# Altium schematic sheet CPU_Power_XTAL_Prog.SchDoc
size B
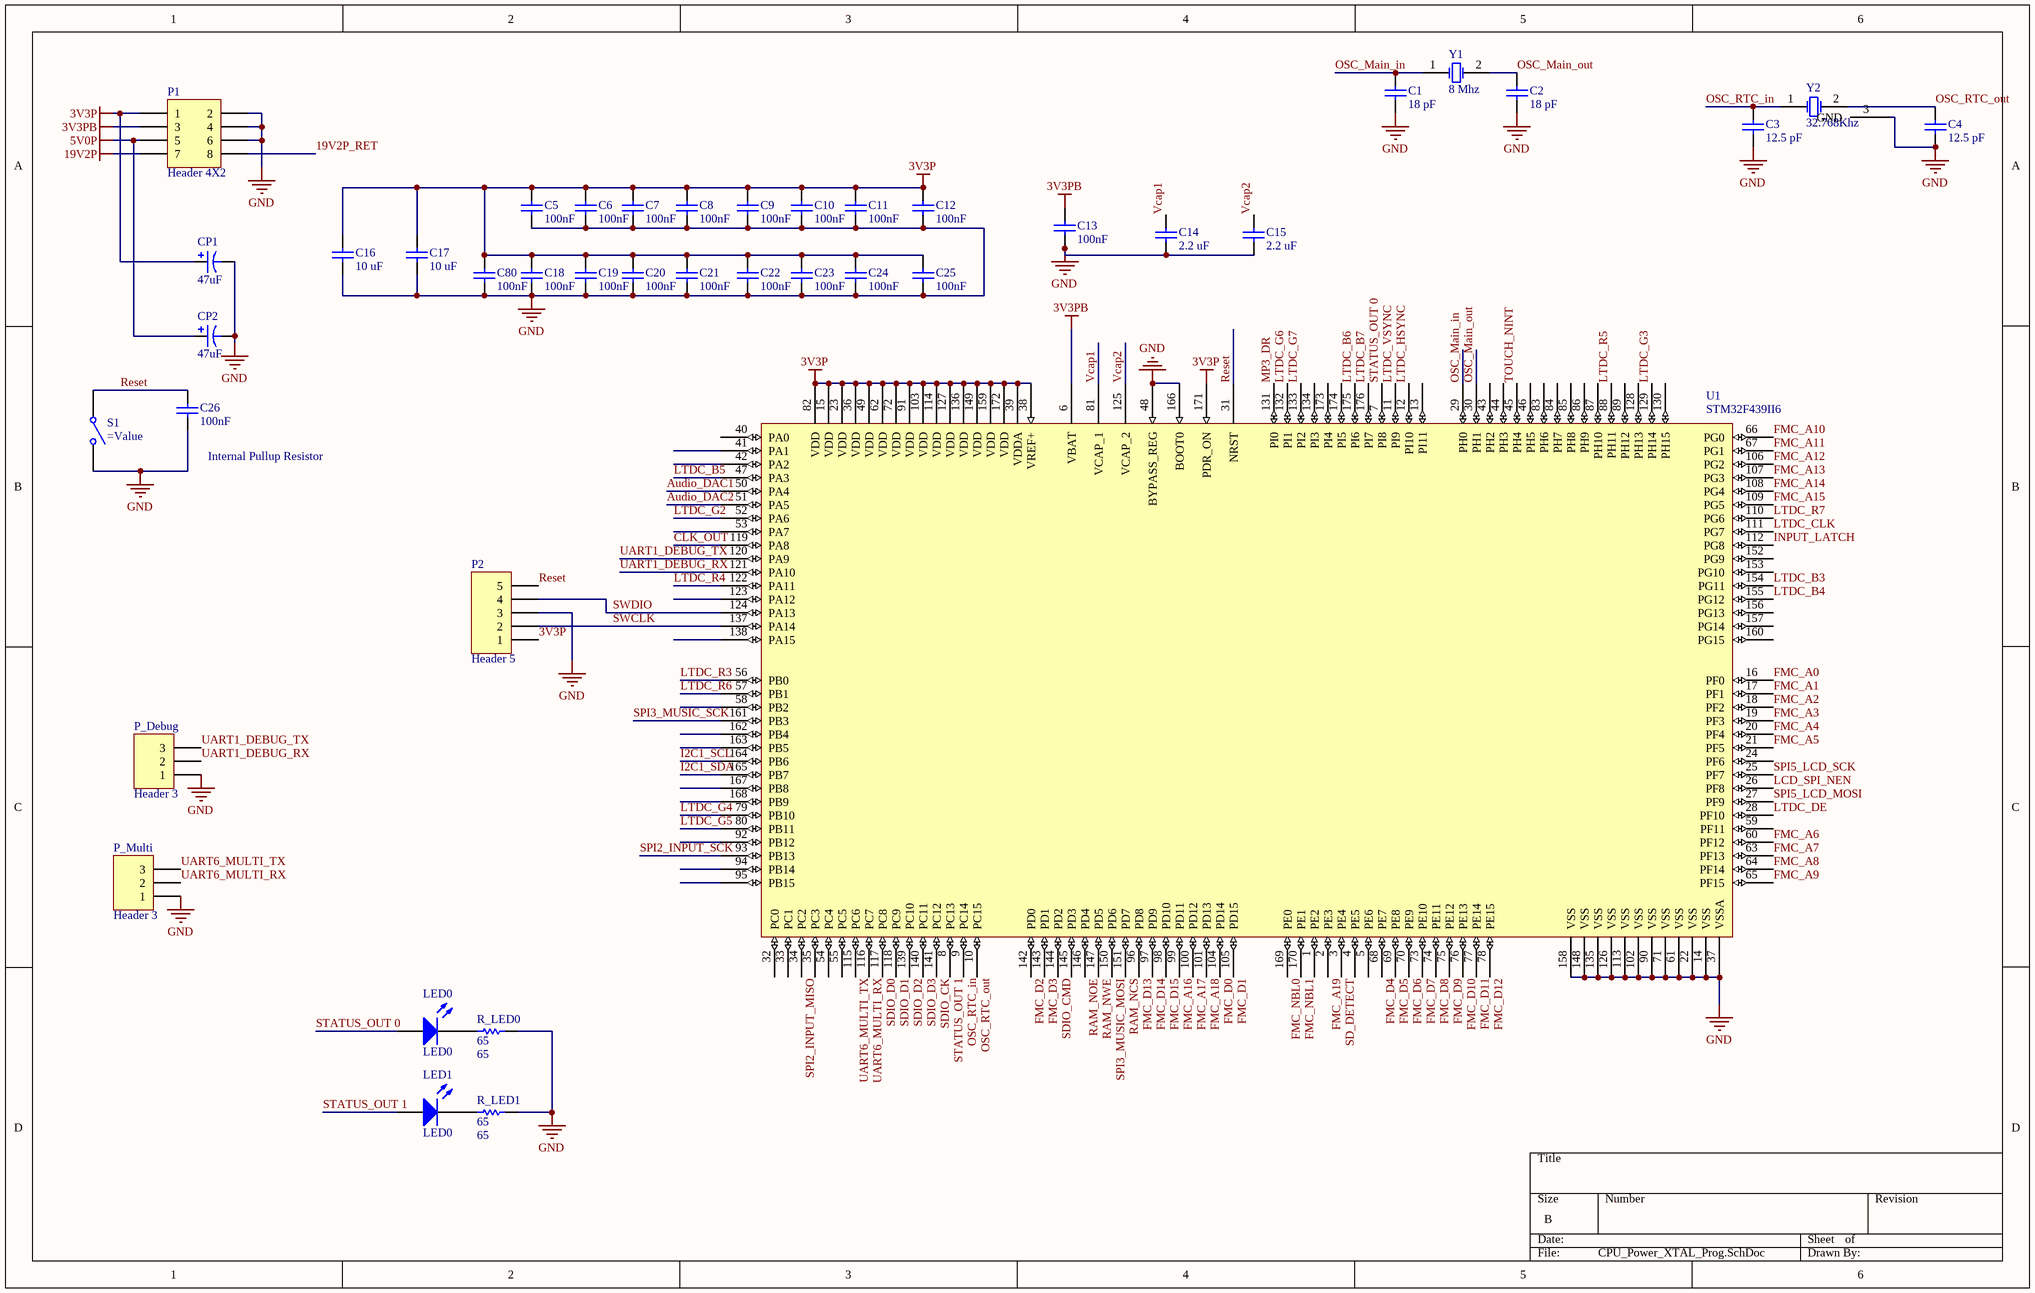
[diagram p0: CPU_Power_XTAL_Prog.SchDoc]

## Parts
C1  18 pF  [C0805]
C2  18 pF  [C0805]
C3  12.5 pF  [C0805]
C4  12.5 pF  [C0805]
C5  100nF  [C0805]
C6  100nF  [C0805]
C7  100nF  [C0805]
C8  100nF  [C0805]
C9  100nF  [C0805]
C10  100nF  [C0805]
C11  100nF  [C0805]
C12  100nF  [C0805]
C13  100nF  [C0805]
C14  2.2 uF  [C0805]
C15  2.2 uF  [C0805]
C16  10 uF  [C0805]
C17  10 uF  [C0805]
C18  100nF  [C0805]
C19  100nF  [C0805]
C20  100nF  [C0805]
C21  100nF  [C0805]
C22  100nF  [C0805]
C23  100nF  [C0805]
C24  100nF  [C0805]
C25  100nF  [C0805]
C26  100nF  [C0805]
C80  100nF  [C0805]
CP1  47uF  [KemetC3]
CP2  47uF  [KemetC3]
LED0  LED0  [LED-LTST]
LED1  LED0  [LED-LTST]
P1  Header 4X2  [Molex MiniFit Jr8]
P2  Header 5  [HDR1X5]
P_Debug  Header 3  [HDR1X3]
P_Multi  Header 3  [HDR1X3]
R_LED0  65  [6-0805_M]
R_LED1  65  [6-0805_M]
S1  (no value)  [Reset_Button]
U1  STM32F439II6  [LQFP76]
Y1  8 Mhz  [HC-49U]
Y2  32.768Khz  [C-2Type Crystal]

## Nets
3V3P: C5.2 C6.2 C7.2 C8.2 C9.2 C10.2 C11.2 C12.2 C16.2 C17.2 C18.2 C19.2 C20.2 C21.2 C22.2 C23.2 C24.2 C25.2 C80.2 CP1.2 P1.1 P2.1 U1.15(VDD) U1.23(VDD) U1.36(VDD) U1.38(VREF+) U1.39(VDDA) U1.49(VDD) U1.62(VDD) U1.72(VDD) U1.82(VDD) U1.91(VDD) U1.103(VDD) U1.114(VDD) U1.127(VDD) U1.136(VDD) U1.149(VDD) U1.159(VDD) U1.171(PDR_ON) U1.172(VDD)
3V3PB: C13.1 P1.3 U1.6(VBAT)
5V0P: CP2.2 P1.5
19V2P: P1.7
GND: C1.1 C2.1 C3.1 C4.1 C5.1 C6.1 C7.1 C8.1 C9.1 C10.1 C11.1 C12.1 C13.2 C14.2 C15.2 C16.1 C17.1 C18.1 C19.1 C20.1 C21.1 C22.1 C23.1 C24.1 C25.1 C26.1 C80.1 CP1.1 CP2.1 P1.2 P1.4 P1.6 P2.3 P_Debug.1 P_Multi.1 R_LED0.2 R_LED1.2 S1.1(NO) U1.14(VSS) U1.22(VSS) U1.37(VSSA) U1.48(BYPASS_REG) U1.61(VSS) U1.71(VSS) U1.90(VSS) U1.102(VSS) U1.113(VSS) U1.126(VSS) U1.135(VSS) U1.148(VSS) U1.158(VSS) U1.166(BOOT0) Y2.3(GND)
19V2P_RET: P1.8
Audio_DAC1: U1.50(PA4)
Audio_DAC2: U1.51(PA5)
CLK_OUT: U1.119(PA8)
FMC_A0: U1.16(PF0)
FMC_A1: U1.17(PF1)
FMC_A2: U1.18(PF2)
FMC_A3: U1.19(PF3)
FMC_A4: U1.20(PF4)
FMC_A5: U1.21(PF5)
FMC_A6: U1.60(PF12)
FMC_A7: U1.63(PF13)
FMC_A8: U1.64(PF14)
FMC_A9: U1.65(PF15)
FMC_A10: U1.66(PG0)
FMC_A11: U1.67(PG1)
FMC_A12: U1.106(PG2)
FMC_A13: U1.107(PG3)
FMC_A14: U1.108(PG4)
FMC_A15: U1.109(PG5)
FMC_A16: U1.99(PD11)
FMC_A17: U1.100(PD12)
FMC_A18: U1.101(PD13)
FMC_A19: U1.2(PE3)
FMC_D0: U1.104(PD14)
FMC_D1: U1.105(PD15)
FMC_D2: U1.142(PD0)
FMC_D3: U1.143(PD1)
FMC_D4: U1.68(PE7)
FMC_D5: U1.69(PE8)
FMC_D6: U1.70(PE9)
FMC_D7: U1.73(PE10)
FMC_D8: U1.74(PE11)
FMC_D9: U1.75(PE12)
FMC_D10: U1.76(PE13)
FMC_D11: U1.77(PE14)
FMC_D12: U1.78(PE15)
FMC_D13: U1.96(PD8)
FMC_D14: U1.97(PD9)
FMC_D15: U1.98(PD10)
FMC_NBL0: U1.169(PE0)
FMC_NBL1: U1.170(PE1)
I2C1_SCL: U1.164(PB6)
I2C1_SDA: U1.165(PB7)
INPUT_LATCH: U1.112(PG8)
LCD_SPI_NEN: U1.26(PF8)
LTDC_B3: U1.154(PG11)
LTDC_B4: U1.155(PG12)
LTDC_B5: U1.47(PA3)
LTDC_B6: U1.175(PI6)
LTDC_B7: U1.176(PI7)
LTDC_CLK: U1.111(PG7)
LTDC_DE: U1.28(PF10)
LTDC_G2: U1.52(PA6)
LTDC_G3: U1.129(PH14)
LTDC_G4: U1.79(PB10)
LTDC_G5: U1.80(PB11)
LTDC_G6: U1.132(PI1)
LTDC_G7: U1.133(PI2)
LTDC_HSYNC: U1.12(PI10)
LTDC_R3: U1.56(PB0)
LTDC_R4: U1.122(PA11)
LTDC_R5: U1.88(PH11)
LTDC_R6: U1.57(PB1)
LTDC_R7: U1.110(PG6)
LTDC_VSYNC: U1.11(PI9)
MP3_DR: U1.131(PI0)
OSC_Main_in: C1.2 U1.29(PH0) Y1.1(OSC1)
OSC_Main_out: C2.2 U1.30(PH1) Y1.2(OSC2)
OSC_RTC_in: C3.2 U1.9(PC14) Y2.1(OSC1)
OSC_RTC_out: C4.2 U1.10(PC15) Y2.2(OSC2)
RAM_NCS: U1.151(PD7)
RAM_NOE: U1.146(PD4)
RAM_NWE: U1.147(PD5)
Reset: C26.2 P2.5 S1.0(COMMON) U1.31(NRST)
SD_DETECT: U1.3(PE4)
SDIO_CK: U1.141(PC12)
SDIO_CMD: U1.144(PD2)
SDIO_D0: U1.117(PC8)
SDIO_D1: U1.118(PC9)
SDIO_D2: U1.139(PC10)
SDIO_D3: U1.140(PC11)
SPI2_INPUT_MISO: U1.34(PC2)
SPI2_INPUT_SCK: U1.93(PB13)
SPI3_MUSIC_MOSI: U1.150(PD6)
SPI3_MUSIC_SCK: U1.161(PB3)
SPI5_LCD_MOSI: U1.27(PF9)
SPI5_LCD_SCK: U1.25(PF7)
STATUS_OUT 0: LED0.A U1.7(PI8)
STATUS_OUT 1: LED1.A U1.8(PC13)
SWCLK: P2.2 U1.137(PA14)
SWDIO: P2.4 U1.124(PA13)
TOUCH_NINT: U1.45(PH4)
UART1_DEBUG_RX: P_Debug.2 U1.121(PA10)
UART1_DEBUG_TX: P_Debug.3 U1.120(PA9)
UART6_MULTI_RX: P_Multi.2 U1.116(PC7)
UART6_MULTI_TX: P_Multi.3 U1.115(PC6)
Vcap1: C14.1 U1.81(VCAP_1)
Vcap2: C15.1 U1.125(VCAP_2)
NetLED0_K: LED0.K R_LED0.1
NetLED1_K: LED1.K R_LED1.1

Not connected (* = marked no-connect by the designer): U1 1(PE2) 4(PE5) 5(PE6) 13(PI11) 24(PF6) 32(PC0) 33(PC1) 35(PC3) 40(PA0) 41(PA1) 42(PA2) 43(PH2) 44(PH3) 46(PH5) 53(PA7) 54(PC4) 55(PC5) 58(PB2) 59(PF11) 83(PH6) 84(PH7) 85(PH8) 86(PH9) 87(PH10) 89(PH12) 92(PB12) 94(PB14) 95(PB15) 123(PA12) 128(PH13) 130(PH15) 134(PI3) 138(PA15) 145(PD3) 152(PG9) 153(PG10) 156(PG13) 157(PG14) 160(PG15) 162(PB4) 163(PB5) 167(PB8) 168(PB9) 173(PI4) 174(PI5)

## Notes on the sheet
- (near C26) Internal Pullup Resistor

## Library data of the parts
C1-C26 C80 = Cap: Capacitor; Published: 8-Jun-2000; LatestRevisionDate: 17-Jul-2002; LatestRevisionNote: Re-released for DXP Platform.; PackageReference: RAD-0.3; Publisher: Altium Limited; PackageDescription: Radial Cap, Thru-Hole; 2 Leads; 0.3 in Pin Spacing
  C1 C2: Value: 18 pF
  C3 C4: Value: 12.5 pF
  C5-C13 C18-C26 C80: Value: 100nF
  C14 C15: Value: 2.2 uF
  C16 C17: Value: 10 uF
CP1 CP2 = Cap Pol1: Polarized Capacitor (Radial); Published: 8-Jun-2000; LatestRevisionDate: 17-Jul-2002; LatestRevisionNote: Re-released for DXP Platform.; PackageReference: RB7.6-15; Publisher: Altium Limited; PackageDescription: Polarized Capacitor (Radial); 2 Leads; Value: 47uF
LED0 LED1 = LED0: Typical INFRARED GaAs LED; Published: 8-Jun-2000; LatestRevisionDate: 08-Jul-2005; LatestRevisionNote: Mech Layer 1 removed.; PackageReference: LED-0; Publisher: Altium Limited; PackageDescription: LED; 2 Leads
P1 = Header 4X2: Header, 4-Pin, Dual row; LatestRevisionDate: 17-Jul-2002; LatestRevisionNote: Re-released for DXP Platform.; Publisher: Altium Limited
P2 = Header 5: Header, 5-Pin; LatestRevisionDate: 17-Jul-2002; LatestRevisionNote: Re-released for DXP Platform.; Publisher: Altium Limited
P_Debug P_Multi = Header 3: Header, 3-Pin; LatestRevisionDate: 17-Jul-2002; LatestRevisionNote: Re-released for DXP Platform.; Publisher: Altium Limited
R_LED0 R_LED1 = Res1: Resistor; Published: 8-Jun-2000; LatestRevisionDate: 17-Jul-2002; LatestRevisionNote: Re-released for DXP Platform.; PackageReference: AXIAL-0.3; Publisher: Altium Limited; PackageDescription: Axial Device, Thru-Hole; 2 Leads; 0.3 in Pin Spacing; Value: 65
S1 = SW-SPST: Single-Pole, Single-Throw Switch; Published: 24-Mar-1999; LatestRevisionDate: 17-Jul-2002; LatestRevisionNote: Re-released for DXP Platform.; PackageReference: SPST-2; Publisher: Altium Limited; PackageDescription: Switch; 2 Leads
U1 = STM32F439IIT6: Arm Cortex M4 Processor
Y1 Y2 = XTAL: Crystal Oscillator; Published: 8-Jun-2000; LatestRevisionDate: 17-Jul-2002; LatestRevisionNote: Re-released for DXP Platform.; PackageReference: R38; Publisher: Altium Limited; PackageDescription: Crystal, Thru-Hole; 2 Leads; Body 3.1 x 8.2 mm (Dia.xH)